# Altium schematic sheet Index.SchDoc
size A4
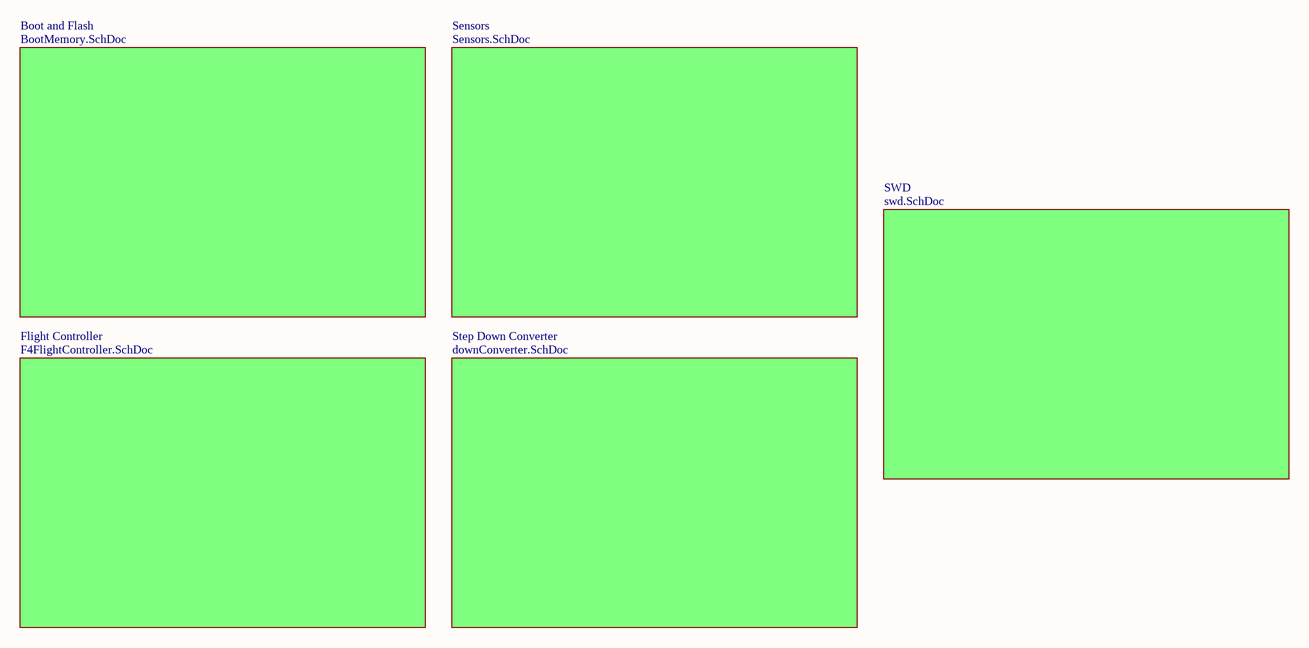
[diagram p0: Index.SchDoc]

## Sub-sheets
Boot and Flash = BootMemory.SchDoc: no entries
Flight Controller = F4FlightController.SchDoc: no entries
Sensors = Sensors.SchDoc: no entries
Step Down Converter = downConverter.SchDoc: no entries
SWD = swd.SchDoc: no entries